# EAGLE schematic MorsePlay_schematic (EAGLE 8.5.2)
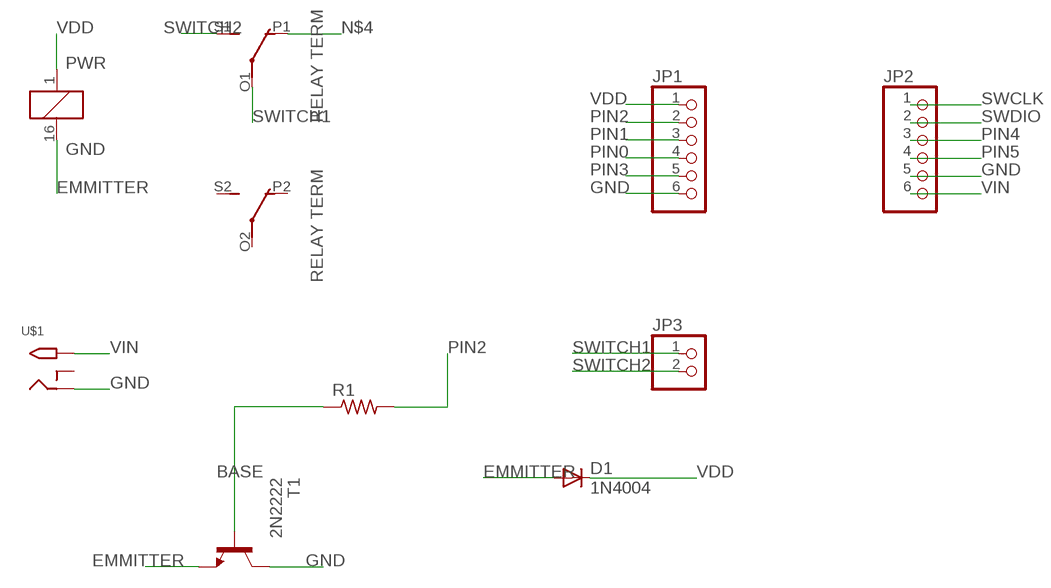
[diagram p0: schematic, sheet 1]

## Parts
D1  1N4004  [DO41-10]
JP1  PINHD-1X6  [1X06]
JP2  PINHD-1X6  [1X06]
JP3  PINHD-1X2  [1X02]
R1  R-US_0204/7  [0204/7]
RELAY1  RELAY_3VTERMINAL  [351]
T1  2N2222  [TO92-EBC-OVAL]
U$1  DCPOWERJACK  [DCJACK_2MM_PTH]

## Nets
BASE: R1.1 T1.B
EMMITTER: D1.A RELAY1.16(GND) T1.E
GND: JP1.6 JP2.5 T1.C U$1.GND(RING)
N$4: RELAY1.P1(POSITIVESIDE:NC)
PIN0: JP1.4
PIN1: JP1.3
PIN2: JP1.2 R1.2
PIN3: JP1.5
PIN4: JP2.3
PIN5: JP2.4
SWCLK: JP2.1
SWDIO: JP2.2
SWITCH1: JP3.1 RELAY1.O1(POSITIVESIDE:COM)
SWITCH2: JP3.2 RELAY1.S1(POSITIVESIDE:NO)
VDD: D1.C JP1.1 RELAY1.1(PWR)
VIN: JP2.6 U$1.PWR(TIP)
Unconnected: RELAY1.O2(NEGATIVESIDE:COM) RELAY1.P2(NEGATIVESIDE:NC) RELAY1.S2(NEGATIVESIDE:NO) U$1.GNDBREAK(RING_SW)

## Library data of the parts
D1 = adafruit:1N4004: DIODE General purpose 1N400x type rectifier (With bigger pads) http://www.ladyada.net/library/pcb/eaglelibrary.html
JP1 JP2 = pinhead:PINHD-1X6: PIN HEADER
JP3 = pinhead:PINHD-1X2: PIN HEADER
R1 = adafruitV2:R-US_: RESISTOR, American symbol
RELAY1 = JOB Parts:RELAY_3V: RELAY 3V 3V Relay by Kemet; OC_FARNELL: unknown; OC_NEWARK: unknown
T1 = adafruit:2N2222: NPN TRANSISTOR Big oval pads
U$1 = JOB Parts:DCPOWERJACK: 2.1 MM DC Power Jack